# Altium schematic sheet CCM4201S_MAIN_Board_V1-PIJIAKUN_20260819_SCH.SchDoc
size D; SheetNumber: 1; SheetTotal: 1
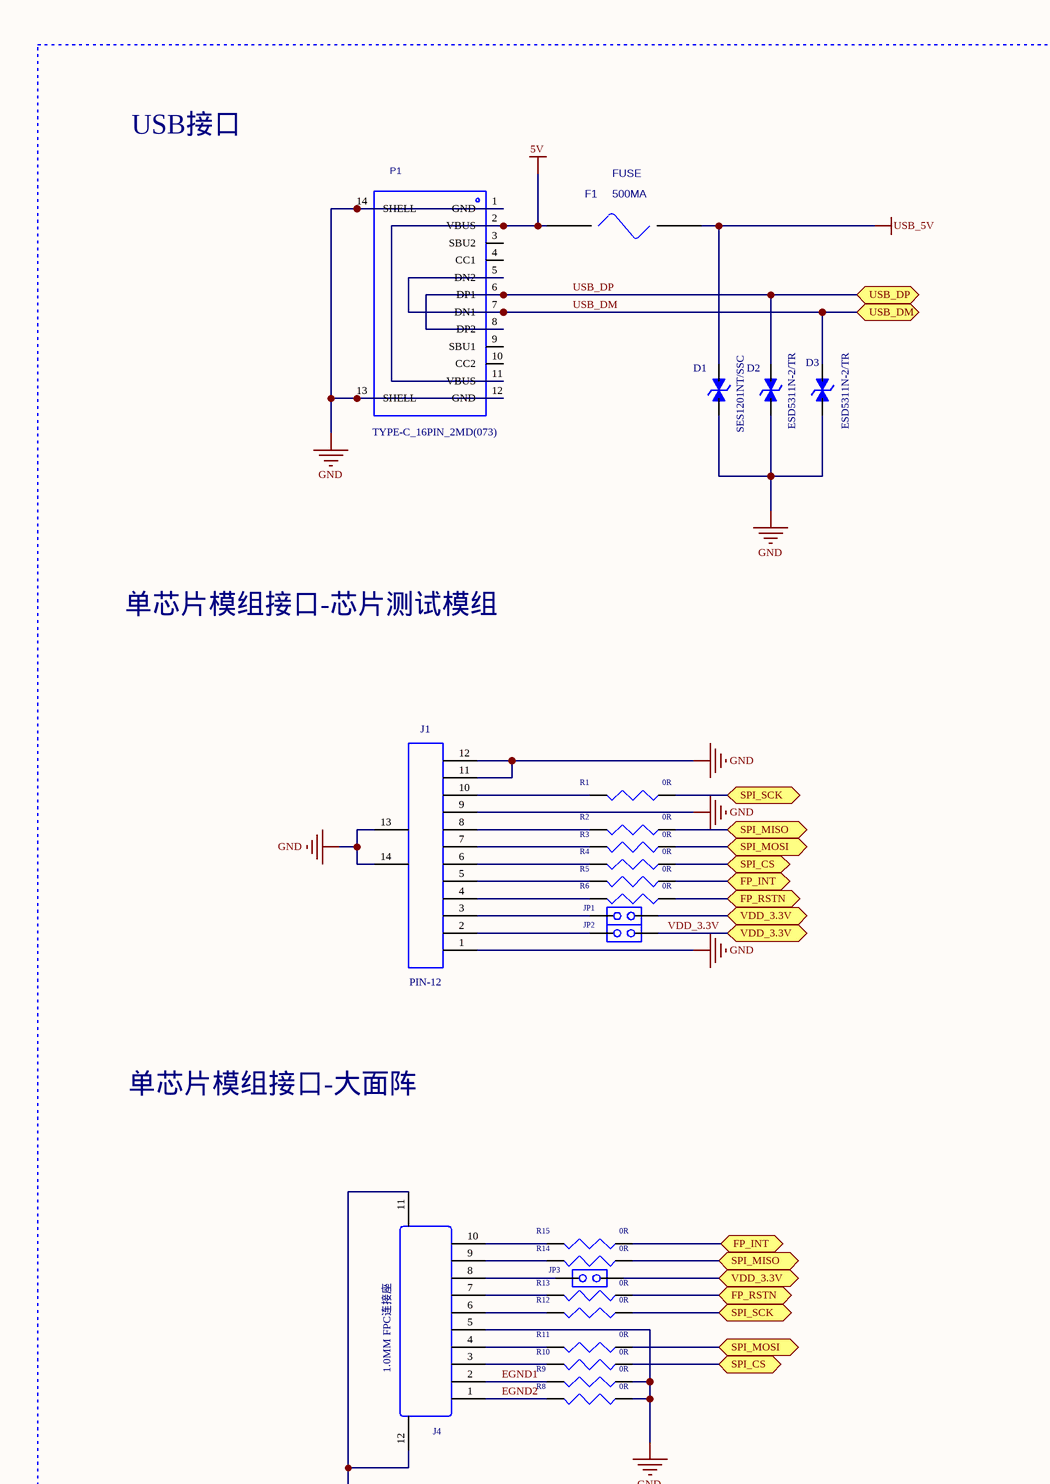
[diagram p0: CCM4201S_MAIN_Board_V1-PIJIAKUN_20260819_SCH.SchDoc, top left]
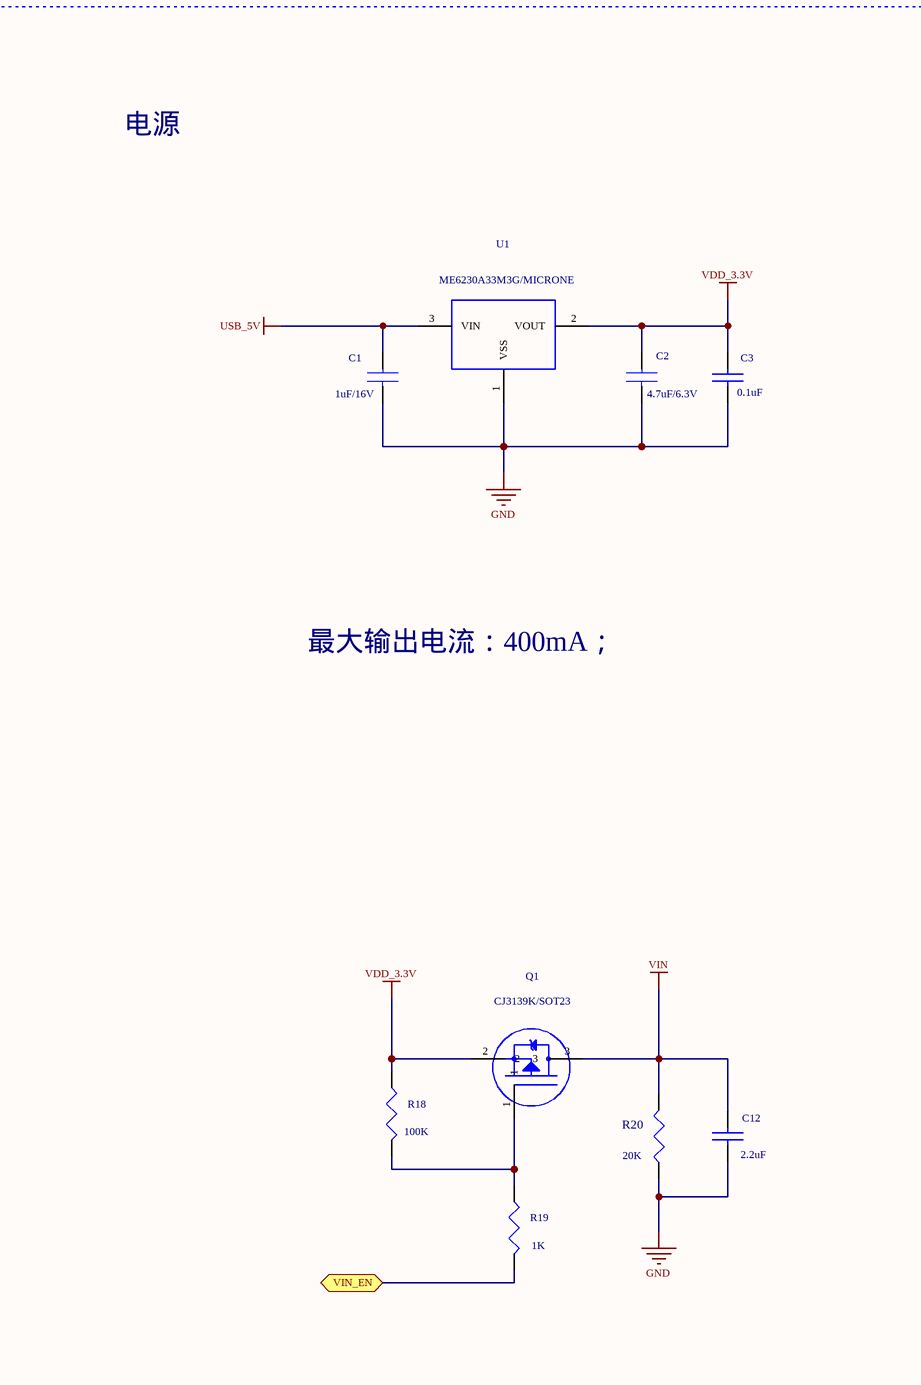
[diagram p1: CCM4201S_MAIN_Board_V1-PIJIAKUN_20260819_SCH.SchDoc, top middle]
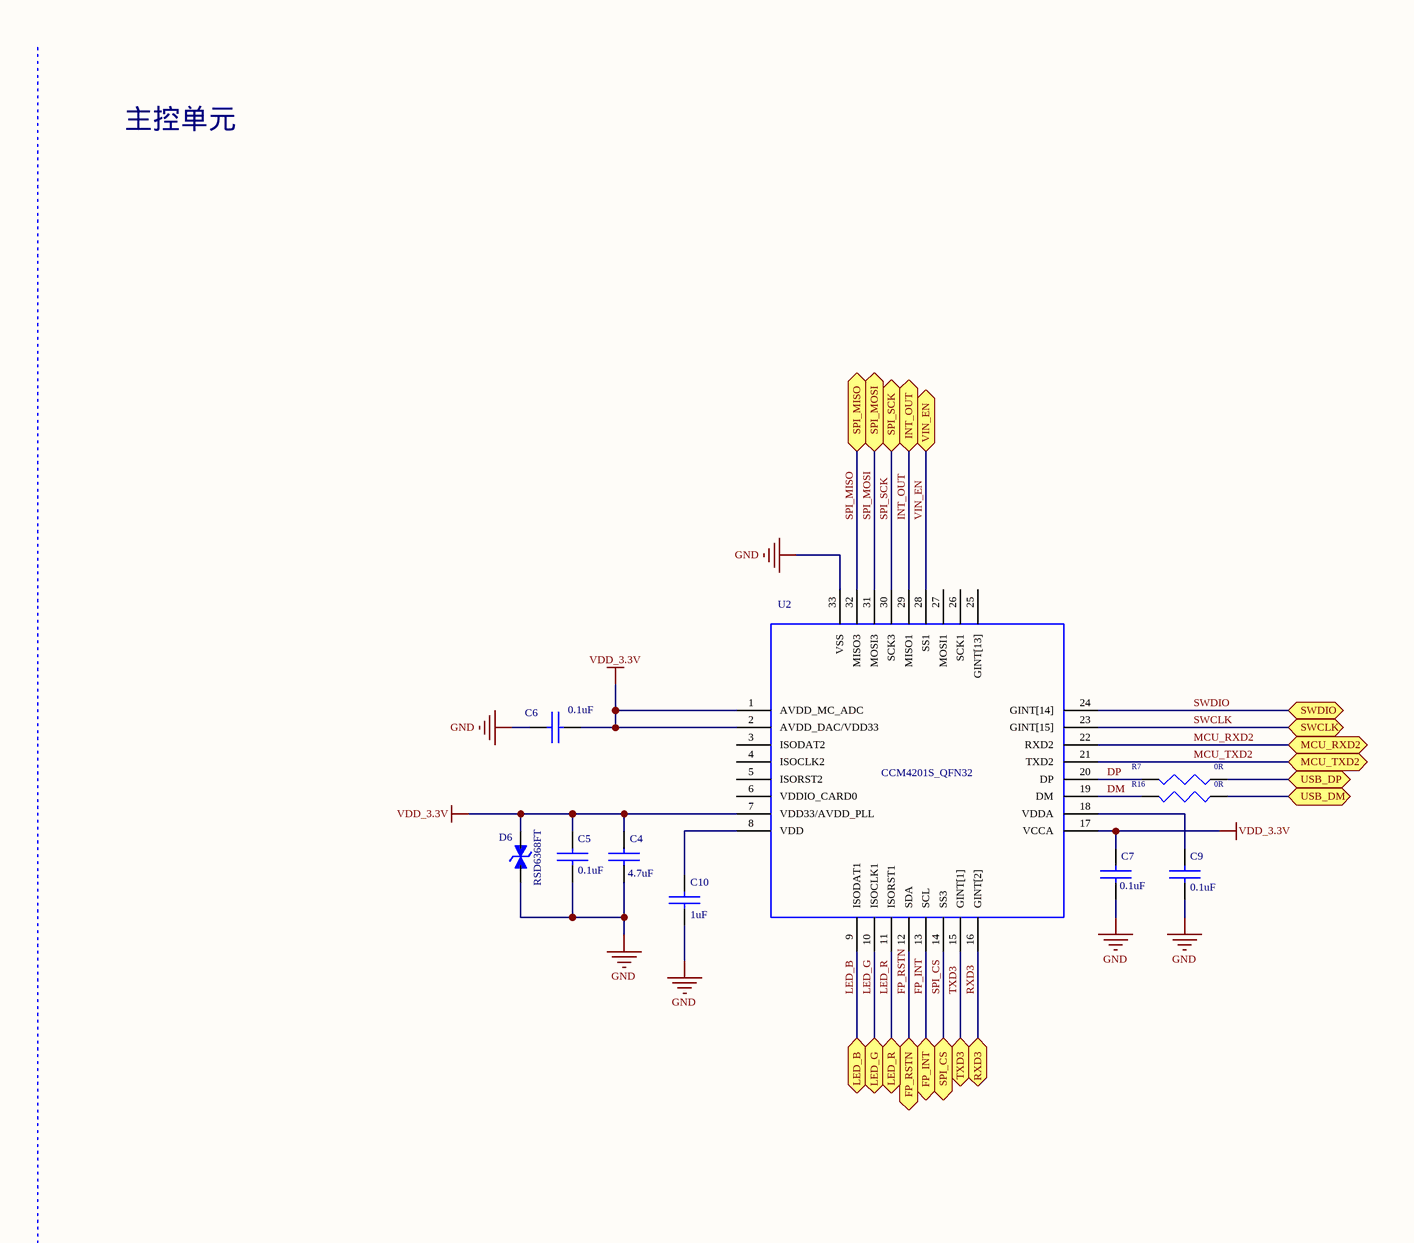
[diagram p2: CCM4201S_MAIN_Board_V1-PIJIAKUN_20260819_SCH.SchDoc, top right]
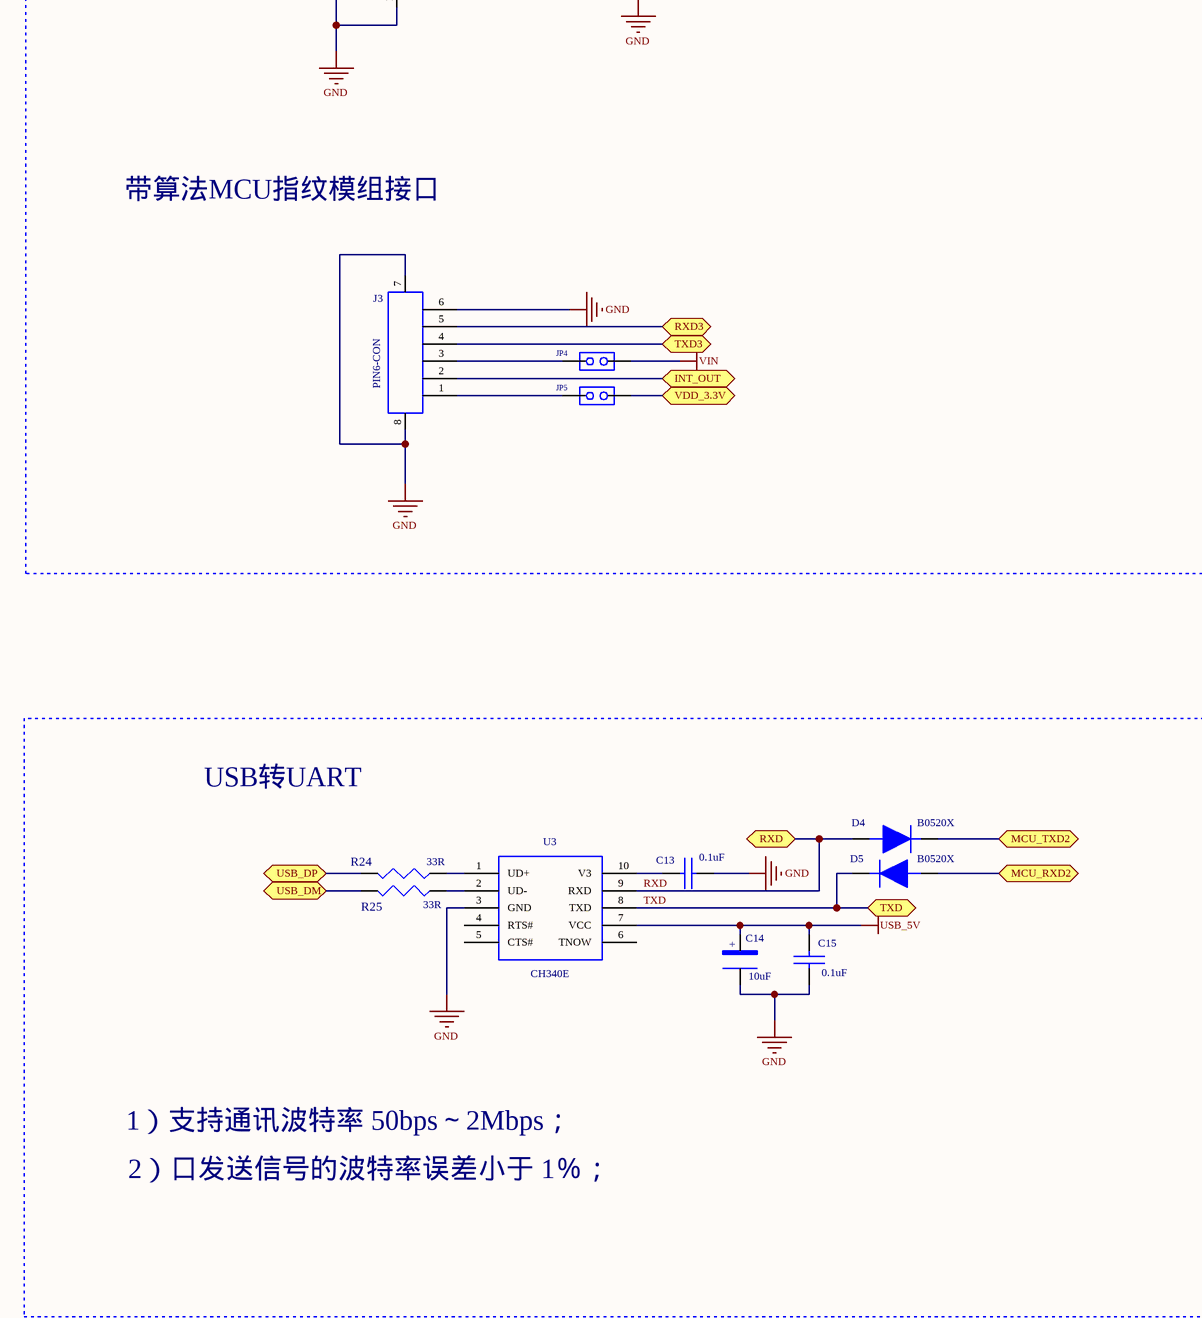
[diagram p3: CCM4201S_MAIN_Board_V1-PIJIAKUN_20260819_SCH.SchDoc, bottom left]
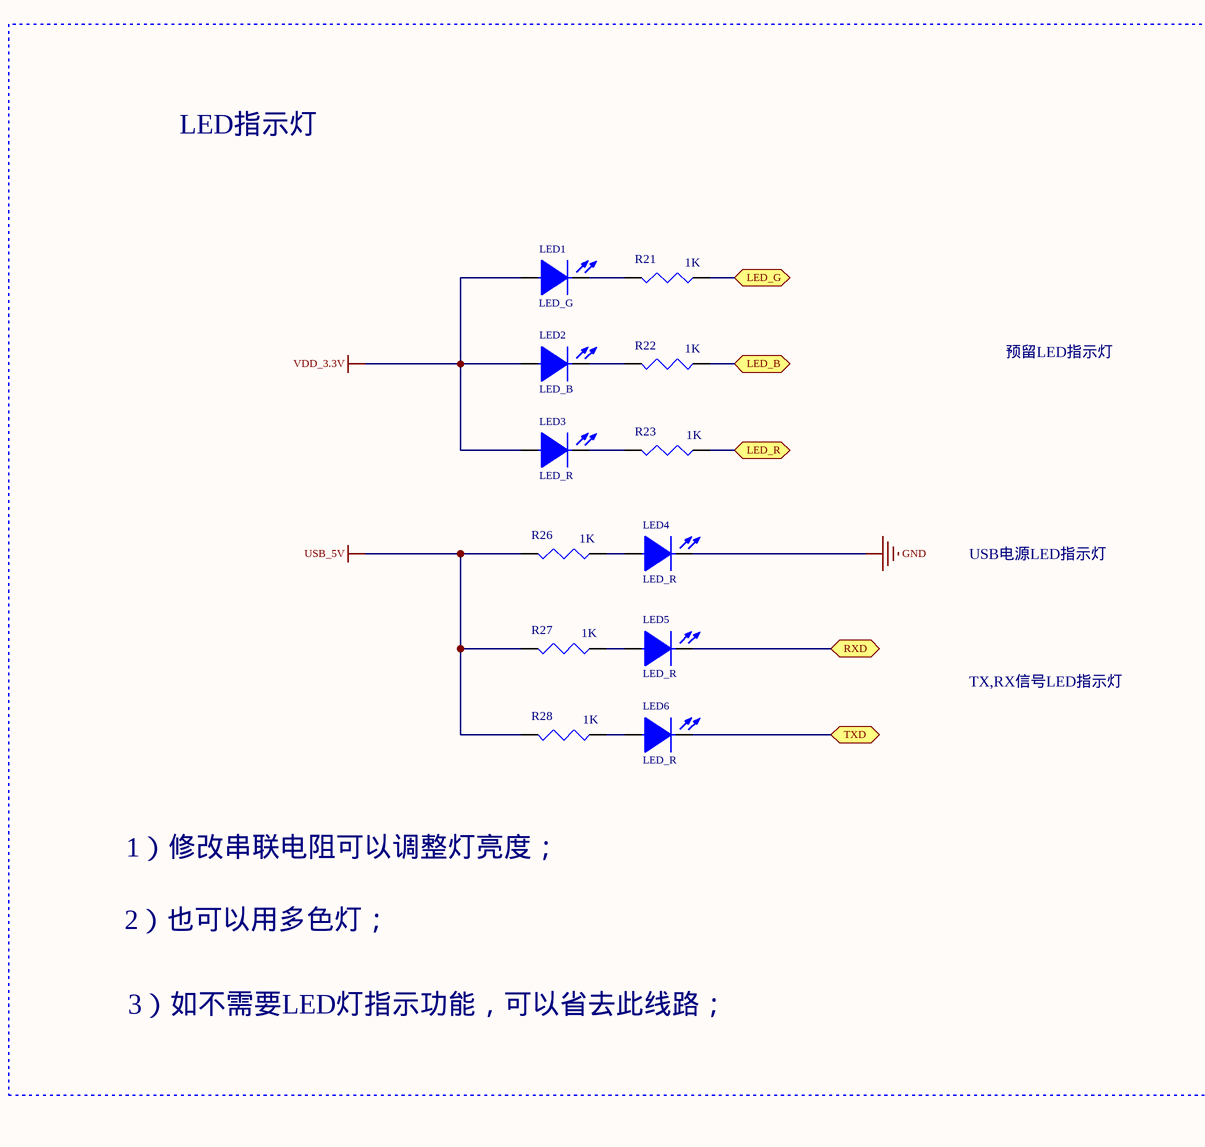
[diagram p4: CCM4201S_MAIN_Board_V1-PIJIAKUN_20260819_SCH.SchDoc, bottom middle]
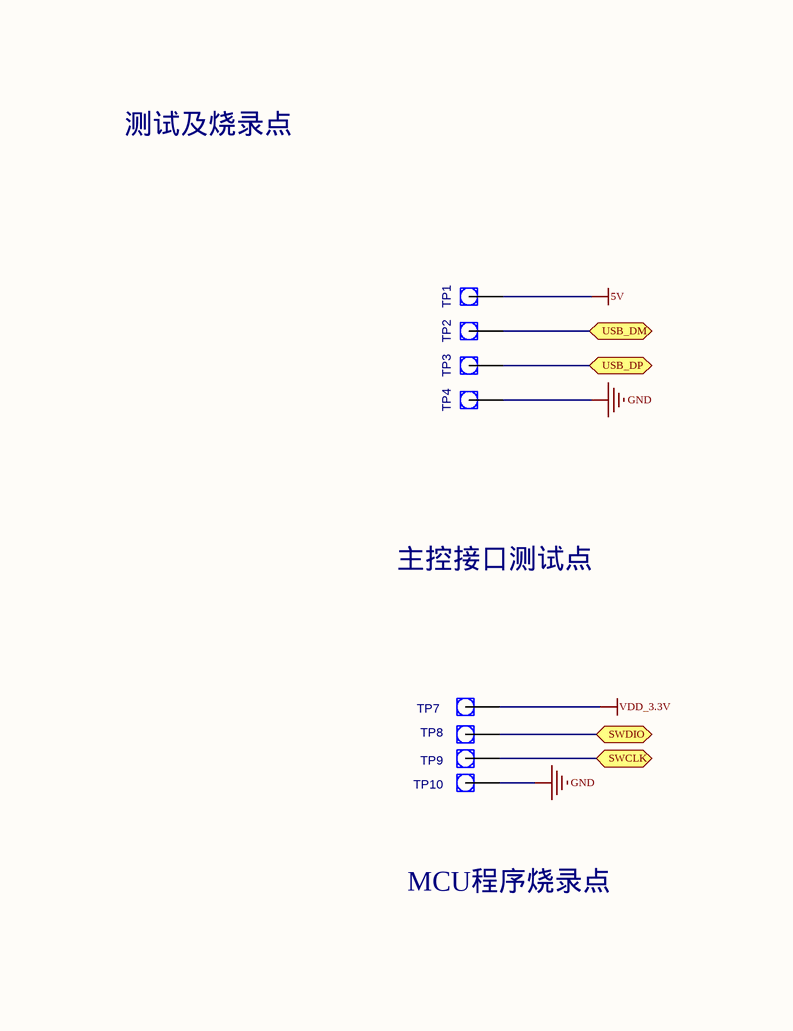
[diagram p5: CCM4201S_MAIN_Board_V1-PIJIAKUN_20260819_SCH.SchDoc, bottom right]

## Parts
C1  1uF/16V  [0402C]
C2  4.7uF/6.3V  [0402C]
C3  0.1uF  [0402C]
C4  4.7uF  [0402C]
C5  0.1uF  [0402C]
C6  0.1uF  [0402C]
C7  0.1uF  [0402C]
C9  0.1uF  [0402C]
C10  1uF  [0402C]
C12  2.2uF  [0402C]
C13  0.1uF  [0402C]
C14  10uF  [L0805]
C15  0.1uF  [0402C]
D1  SES1201NT/SSC  [TVS0402(M)]
D2  ESD5311N-2/TR  [TVS0402(M)]
D3  ESD5311N-2/TR  [TVS0402(M)]
D4  B0520X  [SOD523]
D5  B0520X  [SOD523]
D6  RSD6368FT  [TVS0402(M)]
F1  FUSE  value 500MA  [0603-PUSE]
J1  PIN-12  [PIN-12]
J3  PIN6-CON  [XH6PIN_1.0MM]
J4  Contributor: 1.0MM FPC连接座  [FPC-SMD_10P-P1.0_FGS-XJ-H2.0]  (hidden comment: AFA01-S10FCA-00)
JP1  CONDIP2_A  [PAIZHEN-1.27-2P]  (value not drawn)
JP2  CONDIP2_A  [PAIZHEN-1.27-2P]  (value not drawn)
JP3  CONDIP2_A  [PAIZHEN-1.27-2P]  (value not drawn)
JP4  CONDIP2_A  [PAIZHEN-1.27-2P]  (value not drawn)
JP5  CONDIP2_A  [PAIZHEN-1.27-2P]  (value not drawn)
LED1  LED_G  [LED_G]
LED2  LED_B  [LED_G]
LED3  LED_R  [LED_G]
LED4  LED_R  [LED_G]
LED5  LED_R  [LED_G]
LED6  LED_R  [LED_G]
P1  TYPE-C_16PIN_2MD(073)  [USB-C-SMD_TYPE-C-6PIN-2MD-073]
Q1  CJ3139K/SOT23  [SOT23]
R1  value 0R  [0402R]  (hidden comment: R0402)
R2  value 0R  [0402R]  (hidden comment: R0402)
R3  value 0R  [0402R]  (hidden comment: R0402)
R4  value 0R  [0402R]  (hidden comment: R0402)
R5  value 0R  [0402R]  (hidden comment: R0402)
R6  value 0R  [0402R]  (hidden comment: R0402)
R7  value 0R  [0402R]  (hidden comment: R0402)
R8  value 0R  [0402R]  (hidden comment: R0402)
R9  value 0R  [0402R]  (hidden comment: R0402)
R10  value 0R  [0402R]  (hidden comment: R0402)
R11  value 0R  [0402R]  (hidden comment: R0402)
R12  value 0R  [0402R]  (hidden comment: R0402)
R13  value 0R  [0402R]  (hidden comment: R0402)
R14  value 0R  [0402R]  (hidden comment: R0402)
R15  value 0R  [0402R]  (hidden comment: R0402)
R16  value 0R  [0402R]  (hidden comment: R0402)
R18  100K  [0402R]
R19  1K  [0402R]
R20  20K  [0402R]
R21  1K  [0402R]
R22  1K  [0402R]
R23  1K  [0402R]
R24  33R  [0402R]
R25  33R  [0402R]
R26  1K  [0402R]
R27  1K  [0402R]
R28  1K  [0402R]
TP1  TP12  [TPAA]  (value not drawn)
TP2  TP12  [TPAA]  (value not drawn)
TP3  TP12  [TPAA]  (value not drawn)
TP4  TP12  [TPAA]  (value not drawn)
TP7  TP12  [TPAA]  (value not drawn)
TP8  TP12  [TPAA]  (value not drawn)
TP9  TP12  [TPAA]  (value not drawn)
TP10  TP12  [TPAA]  (value not drawn)
U1  ME6230A33M3G/MICRONE  [SOT23-3]
U2  CCM4201S_QFN32  [QFN32_4X4_0.4]
U3  CH340E  [MSOP-10]

## Ports
FP_INT (bidir, see CCM4201S_MAIN_Board_V1-PIJIAKUN_20260819_SCH[2B]), FP_INT (bidir, see CCM4201S_MAIN_Board_V1-PIJIAKUN_20260819_SCH[2B], CCM4201S_MAIN_Board_V1-PIJIAKUN_20260819_SCH[7B]), FP_RSTN (bidir, see CCM4201S_MAIN_Board_V1-PIJIAKUN_20260819_SCH[2B]), FP_RSTN (bidir, see CCM4201S_MAIN_Board_V1-PIJIAKUN_20260819_SCH[2B], CCM4201S_MAIN_Board_V1-PIJIAKUN_20260819_SCH[7B]), INT_OUT (bidir, see CCM4201S_MAIN_Board_V1-PIJIAKUN_20260819_SCH[2C]), INT_OUT (bidir, see CCM4201S_MAIN_Board_V1-PIJIAKUN_20260819_SCH[7A]), LED_B (bidir, see CCM4201S_MAIN_Board_V1-PIJIAKUN_20260819_SCH[4C]), LED_B (bidir, see CCM4201S_MAIN_Board_V1-PIJIAKUN_20260819_SCH[7B]), LED_G (bidir, see CCM4201S_MAIN_Board_V1-PIJIAKUN_20260819_SCH[4C]), LED_G (bidir, see CCM4201S_MAIN_Board_V1-PIJIAKUN_20260819_SCH[7B]), LED_R (bidir, see CCM4201S_MAIN_Board_V1-PIJIAKUN_20260819_SCH[4C]), LED_R (bidir, see CCM4201S_MAIN_Board_V1-PIJIAKUN_20260819_SCH[7B]), MCU_RXD2 (bidir, see CCM4201S_MAIN_Board_V1-PIJIAKUN_20260819_SCH[3C]), MCU_RXD2 (bidir, see CCM4201S_MAIN_Board_V1-PIJIAKUN_20260819_SCH[7B]), MCU_TXD2 (bidir, see CCM4201S_MAIN_Board_V1-PIJIAKUN_20260819_SCH[3C]), MCU_TXD2 (bidir, see CCM4201S_MAIN_Board_V1-PIJIAKUN_20260819_SCH[7B]), RXD3 (bidir, see CCM4201S_MAIN_Board_V1-PIJIAKUN_20260819_SCH[2C]), RXD3 (bidir, see CCM4201S_MAIN_Board_V1-PIJIAKUN_20260819_SCH[7B]), RXD (bidir, see CCM4201S_MAIN_Board_V1-PIJIAKUN_20260819_SCH[2C]), RXD (bidir, see CCM4201S_MAIN_Board_V1-PIJIAKUN_20260819_SCH[5C]), SPI_CS (bidir, see CCM4201S_MAIN_Board_V1-PIJIAKUN_20260819_SCH[2B]), SPI_CS (bidir, see CCM4201S_MAIN_Board_V1-PIJIAKUN_20260819_SCH[2B], CCM4201S_MAIN_Board_V1-PIJIAKUN_20260819_SCH[7B]), SPI_MISO (bidir, see CCM4201S_MAIN_Board_V1-PIJIAKUN_20260819_SCH[2B]), SPI_MISO (bidir, see CCM4201S_MAIN_Board_V1-PIJIAKUN_20260819_SCH[2B], CCM4201S_MAIN_Board_V1-PIJIAKUN_20260819_SCH[7A]), SPI_MOSI (bidir, see CCM4201S_MAIN_Board_V1-PIJIAKUN_20260819_SCH[2B]), SPI_MOSI (bidir, see CCM4201S_MAIN_Board_V1-PIJIAKUN_20260819_SCH[2B], CCM4201S_MAIN_Board_V1-PIJIAKUN_20260819_SCH[7A]), SPI_SCK (bidir, see CCM4201S_MAIN_Board_V1-PIJIAKUN_20260819_SCH[2B]), SPI_SCK (bidir, see CCM4201S_MAIN_Board_V1-PIJIAKUN_20260819_SCH[2B], CCM4201S_MAIN_Board_V1-PIJIAKUN_20260819_SCH[7A]), SWCLK (bidir, see CCM4201S_MAIN_Board_V1-PIJIAKUN_20260819_SCH[6D]), SWCLK (bidir, see CCM4201S_MAIN_Board_V1-PIJIAKUN_20260819_SCH[7B]), SWDIO (bidir, see CCM4201S_MAIN_Board_V1-PIJIAKUN_20260819_SCH[6D]), SWDIO (bidir, see CCM4201S_MAIN_Board_V1-PIJIAKUN_20260819_SCH[7B]), TXD3 (bidir, see CCM4201S_MAIN_Board_V1-PIJIAKUN_20260819_SCH[2C]), TXD3 (bidir, see CCM4201S_MAIN_Board_V1-PIJIAKUN_20260819_SCH[7B]), TXD (bidir, see CCM4201S_MAIN_Board_V1-PIJIAKUN_20260819_SCH[3D]), TXD (bidir, see CCM4201S_MAIN_Board_V1-PIJIAKUN_20260819_SCH[5D]), USB_DM (bidir, see CCM4201S_MAIN_Board_V1-PIJIAKUN_20260819_SCH[2D], CCM4201S_MAIN_Board_V1-PIJIAKUN_20260819_SCH[3A], CCM4201S_MAIN_Board_V1-PIJIAKUN_20260819_SCH[6C]), USB_DM (bidir, see CCM4201S_MAIN_Board_V1-PIJIAKUN_20260819_SCH[2D], CCM4201S_MAIN_Board_V1-PIJIAKUN_20260819_SCH[3A], CCM4201S_MAIN_Board_V1-PIJIAKUN_20260819_SCH[7B]), USB_DM (bidir, see CCM4201S_MAIN_Board_V1-PIJIAKUN_20260819_SCH[2D], CCM4201S_MAIN_Board_V1-PIJIAKUN_20260819_SCH[6C], CCM4201S_MAIN_Board_V1-PIJIAKUN_20260819_SCH[7B]), USB_DM (bidir, see CCM4201S_MAIN_Board_V1-PIJIAKUN_20260819_SCH[3A], CCM4201S_MAIN_Board_V1-PIJIAKUN_20260819_SCH[6C], CCM4201S_MAIN_Board_V1-PIJIAKUN_20260819_SCH[7B]), USB_DP (bidir, see CCM4201S_MAIN_Board_V1-PIJIAKUN_20260819_SCH[2C], CCM4201S_MAIN_Board_V1-PIJIAKUN_20260819_SCH[3A], CCM4201S_MAIN_Board_V1-PIJIAKUN_20260819_SCH[6C]), USB_DP (bidir, see CCM4201S_MAIN_Board_V1-PIJIAKUN_20260819_SCH[2C], CCM4201S_MAIN_Board_V1-PIJIAKUN_20260819_SCH[3A], CCM4201S_MAIN_Board_V1-PIJIAKUN_20260819_SCH[7B]), USB_DP (bidir, see CCM4201S_MAIN_Board_V1-PIJIAKUN_20260819_SCH[2C], CCM4201S_MAIN_Board_V1-PIJIAKUN_20260819_SCH[6C], CCM4201S_MAIN_Board_V1-PIJIAKUN_20260819_SCH[7B]), USB_DP (bidir, see CCM4201S_MAIN_Board_V1-PIJIAKUN_20260819_SCH[3A], CCM4201S_MAIN_Board_V1-PIJIAKUN_20260819_SCH[6C], CCM4201S_MAIN_Board_V1-PIJIAKUN_20260819_SCH[7B]), VDD_3.3V (bidir, see CCM4201S_MAIN_Board_V1-PIJIAKUN_20260819_SCH[2B]), VDD_3.3V (bidir, see CCM4201S_MAIN_Board_V1-PIJIAKUN_20260819_SCH[2B], CCM4201S_MAIN_Board_V1-PIJIAKUN_20260819_SCH[2C]), VIN_EN (bidir, see CCM4201S_MAIN_Board_V1-PIJIAKUN_20260819_SCH[4B]), VIN_EN (bidir, see CCM4201S_MAIN_Board_V1-PIJIAKUN_20260819_SCH[7A])

## Nets
5V: F1.1 P1.2(VBUS) P1.11(VBUS) TP1.1
GND: C1.2 C2.2 C3.2 C4.2 C5.2 C6.1 C7.2 C9.2 C10.2 C12.2 C13.2 C14.2 C15.2 D1.1 D2.1 D3.1 D6.2 J1.1 J1.9 J1.11 J1.12 J1.13 J1.14 J3.6 J3.7 J3.8 J4.5 J4.11 J4.12 LED4.2 P1.1(GND) P1.12(GND) P1.13(SHELL) P1.14(SHELL) R8.1 R9.1 R20.1 TP4.1 TP10.1 U1.1(VSS) U2.33(VSS) U3.3(GND)
USB_5V: C1.1 C14.1 C15.1 D1.2 F1.2 R26.2 R27.2 R28.2 U1.3(VIN) U3.7(VCC)
VDD_3.3V: C2.1 C3.1 C4.1 C5.1 C6.2 C7.1 D6.1 JP1.1 JP2.1 JP3.1 JP5.1 LED1.1 LED2.1 LED3.1 Q1.2 R18.2 TP7.1 U1.2(VOUT) U2.1(AVDD_MC_ADC) U2.2(AVDD_DAC/VDD33) U2.7(VDD33/AVDD_PLL) U2.17(VCCA) ; port VDD_3.3V
VIN: C12.1 JP4.1 Q1.3 R20.2
DM: R16.2 U2.19(DM)
DP: R7.2 U2.20(DP)
EGND1: J4.2 R9.2
EGND2: J4.1 R8.2
FP_INT: R5.1 R15.1 U2.13(SCL) ; port FP_INT
FP_RSTN: R6.1 R13.1 U2.12(SDA) ; port FP_RSTN
INT_OUT: J3.2 U2.29(MISO1) ; port INT_OUT
LED_B: R22.1 U2.9(ISODAT1) ; port LED_B
LED_G: R21.1 U2.10(ISOCLK1) ; port LED_G
LED_R: R23.1 U2.11(ISORST1) ; port LED_R
MCU_RXD2: D5.A U2.22(RXD2) ; port MCU_RXD2
MCU_TXD2: D4.K U2.21(TXD2) ; port MCU_TXD2
RXD: D4.A LED5.2 U3.9(RXD) ; port RXD
RXD3: J3.5 U2.16(GINT[2]) ; port RXD3
SPI_CS: R4.1 R10.1 U2.14(SS3) ; port SPI_CS
SPI_MISO: R2.1 R14.1 U2.32(MISO3) ; port SPI_MISO
SPI_MOSI: R3.1 R11.1 U2.31(MOSI3) ; port SPI_MOSI
SPI_SCK: R1.1 R12.1 U2.30(SCK3) ; port SPI_SCK
SWCLK: TP9.1 U2.23(GINT[15]) ; port SWCLK
SWDIO: TP8.1 U2.24(GINT[14]) ; port SWDIO
TXD: D5.K LED6.2 U3.8(TXD) ; port TXD
TXD3: J3.4 U2.15(GINT[1]) ; port TXD3
USB_DM: D3.2 P1.5(DN2) P1.7(DN1) R16.1 R25.2 TP2.1 ; port USB_DM
USB_DP: D2.2 P1.6(DP1) P1.8(DP2) R7.1 R24.2 TP3.1 ; port USB_DP
VIN_EN: R19.1 U2.28(SS1) ; port VIN_EN
NetC9_1: C9.1 U2.18(VDDA)
NetC10_1: C10.1 U2.8(VDD)
NetC13_1: C13.1 U3.10(V3)
NetJ1_2: J1.2 JP2.2
NetJ1_3: J1.3 JP1.2
NetJ1_4: J1.4 R6.2
NetJ1_5: J1.5 R5.2
NetJ1_6: J1.6 R4.2
NetJ1_7: J1.7 R3.2
NetJ1_8: J1.8 R2.2
NetJ1_10: J1.10 R1.2
NetJ3_1: J3.1 JP5.2
NetJ3_3: J3.3 JP4.2
NetJ4_3: J4.3 R10.2
NetJ4_4: J4.4 R11.2
NetJ4_6: J4.6 R12.2
NetJ4_7: J4.7 R13.2
NetJ4_8: J4.8 JP3.2
NetJ4_9: J4.9 R14.2
NetJ4_10: J4.10 R15.2
NetLED1_2: LED1.2 R21.2
NetLED2_2: LED2.2 R22.2
NetLED3_2: LED3.2 R23.2
NetLED4_1: LED4.1 R26.1
NetLED5_1: LED5.1 R27.1
NetLED6_1: LED6.1 R28.1
NetQ1_1: Q1.1 R18.1 R19.2
NetR24_1: R24.1 U3.1(UD+)
NetR25_1: R25.1 U3.2(UD-)

Not connected (* = marked no-connect by the designer): P1 3(SBU2) 4(CC1) 9(SBU1) 10(CC2); U2 3(ISODAT2) 4(ISOCLK2) 5(ISORST2) 6(VDDIO_CARD0) 25(GINT[13]) 26(SCK1) 27(MOSI1); U3 4(RTS#) 5(CTS#) 6(TNOW)

## Notes on the sheet
- USB接口
- 电源
- 主控单元
- 单芯片模组接口-芯片测试模组
- 最大输出电流：400mA；
- 单芯片模组接口-大面阵
- 带算法MCU指纹模组接口
- LED指示灯
- 测试及烧录点
- 预留LED指示灯
- USB转UART
- USB电源LED指示灯
- 主控接口测试点
- TX,RX信号LED指示灯
- 1）修改串联电阻可以调整灯亮度；
- 1）支持通讯波特率 50bps～2Mbps；
- 2）也可以用多色灯；
- MCU程序烧录点
- 2）口发送信号的波特率误差小于 1％；
- 3）如不需要LED灯指示功能，可以省去此线路；
- THIS DOCUMENT AND THE DATA DISCLOSED HEREIN OR
- HEREWITH IS THE PROPERTY OF ALTIUM LIMITED AND MAY
- DWG NO:
- REVISION
- REV:
- DESCRIPTION
- DATE
- APPROVED
- BE FREELY DISTRIBUTED IN WHOLE. NO RIGHTS ARE
- RESERVED OR EXPRESS OR IMPLIED WARANTEE GIVEN.
- ENG:
- APPROVALS
- PROJECT
- DSN:
- CHK:
- REFERENCE DOCUMENTS
- PROJECT REVISION:
- TITLE
- DOCUMENT REVISION:
- DESIGN ITEM:
- BOM:
- FAB DWG:
- PCB DWG:
- ASSY DWG:
- SCALE:
- A3
- SIZE
- CAGE CODE
- FILE NAME
- DWG NO.
- SHEET
- OF
- REV
- (in symbol CAP+) +

## Library data of the parts
C1 C2 = C0603X: CAP, 10UF, 20%, 10V, X5R, 0603; Manufacturer #1: 村田 muRata; Manufacturer: muRata (村田); PCB_DECAL: C0805; Process: SMT; Geometry.Height: 1.45000mm; PCB DECAL: 0402C
C3 C5-C7 C9 = C0402: CAP, 0.1uF, 10%, 10V, X5R, 0402; Manufacturer #1: 村田 muRata; PCB DECAL: 0402C
C4 C10 = C0402: CAP, 1UF, 10%, 10V, X5R, 0402; Manufacturer #1: 村田 muRata; PCB DECAL: 0402C
C12 = C0201: CAP, 2.2uF, 10%, 10V, X5R, 0201; Manufacturer #1: 村田 muRata; PCB DECAL: 0402C
C13 C15 = C0201: CAP, 0.1uF, 10%, 10V, X5R, 0201; Manufacturer #1: 村田 muRata; Source_Path: D:\王君资料\客户资料\奥美佳\TDC5502\SCHEMATIC\改过原理图\TDC5502 1210B56101MN32SSD32FTD020EARIGBT.DSN; PCB DECAL: 0402C
C14 = CAP+: CAP, 10uF, 10%, 16V  6.3*5.3mm SMD; Geometry.Height: 1.19990mm; PCB DECAL: L0805
D1 = TVS0402(M): TVS/12V; Part Number: 1.5KE220; Manufacturer #1: MOTOROLA; Source_Path: D:\工作资料\指纹锁\电子烟\TF30X原理图\TF30X-GSL6165S-V00.DSN; PCB DECAL: TVS0402(M)
D2 D3 = TVS0402(M): TVS/5V; Part Number: 1.5KE220; Manufacturer #1: MOTOROLA; Source_Path: D:\工作资料\指纹锁\电子烟\TF30X原理图\TF30X-GSL6165S-V00.DSN; PCB DECAL: TVS0402(M)
D4 D5 = DIODE: Value: B0520; PCB DECAL: SOD523
D6 = TVS0402(M): TRANSIENT VOLTAGE SUPPRESSOR, VBR=220V; Part Number: 1.5KE220; Manufacturer #1: MOTOROLA; Source_Path: D:\工作资料\指纹锁\电子烟\TF30X原理图\TF30X-GSL6165S-V00.DSN; Value: RSFK9D3NT; Geometry.Height: 1.10007mm; PCB DECAL: TVS0402(M)
F1 = FUSE: Source_Path: C:\PROGRAM FILES\CADENCE\SPB_15.7\TOOLS\CAPTURE\LIBRARY\OLDLIBS\DEVICE.OLB; PCB DECAL: 0603-PUSE
J4 = AFA01-S10FCA-00: BOM_Manufacturer: JUSHUO; BOM_Supplier: LCSC; BOM_Supplier_Part: C262756; BOM_Manufacturer_Part: AFA01-S10FCA-00; BOM_JLCPCB_Part_Class: Extended Part; spicePre: F; spiceSymbolName: AFA01-S10FCA-00; PCB DECAL: FPC-SMD_10P-P1.0_FGS-XJ-H2.0
JP1-JP5 = CONDIP2_A: Rechargeable Battery; Value: 4.2V/0.5A; PCB DECAL: PAIZHEN-1.27-2P
LED1-LED6 = OLED: Geometry.Height: 1.100mm; PCB DECAL: LED_G
P1 = TYPE-C_16PIN_2MD(073): Symbol: TYPE-C 16PIN 2MD(073); Add_into_BOM: yes; Connector_Type: Type-C; Number_of_Contacts: 16; Number_of_Ports: 1; Current_Rating___Power_(Max): 5A; Name: =Manufacturer Part; Device: TYPE-C 16PIN 2MD(073); Supplier_Part: C2765186; Manufacturer_Part: TYPE-C 16PIN 2MD(073); Supplier_Footprint: SMD; JLCPCB_Part_Class: Extended Part; Datasheet: https://atta.szlcsc.com/upload/public/pdf/source/20211123/39B17C16241EAC15C5E277BDA434118E.pdf; Supplier: LCSC; Convert_to_PCB: yes; Standard: -; PCB DECAL: USB-C-SMD_TYPE-C-6PIN-2MD-073
Q1 = PMOS: SOT23; Manufacturer #1: 长电科技; PCB DECAL: SOT23
R1-R16 = R0402: RES,330R, 5%, 1/10W, 0201, SMD; Manufacturer #1: Yageo; Part_Name: RES 0201; PCB DECAL: 0402R
R18 R19 = R0402H: RES 0603  4.7KΩ±1%  1/8W; PCB_DECAL: R0603; Specification: spec; Process: SMT; PCB DECAL: 0402R
R20-R23 R26-R28 = R0402: RES,20K, 5%, 1/10W, 0201, SMD; Manufacturer #1: Yageo; Part_Name: RES 0201; PCB DECAL: 0402R
R24 R25 = R0201: Source_Path: C:\PROGRAM FILES\ORCAD\CAPTURE\LIBRARY\DISCRETE.OLB; PCB DECAL: 0402R
TP1-TP4 TP7-TP10 = TP12: 测试点，不需要贴片; PCB DECAL: TPAA
U1 = TCS2115_C33: 3.3V  SOT23-3; Manufacturer #1: Torch_chip; PCB DECAL: SOT23-3
U3 = CH340E: Geometry.Height: 1.09mm; PCB DECAL: MSOP-10
J1 = PIN-12: PCB DECAL: PIN-12
J3 = PIN6-CON: PCB DECAL: XH6PIN_1.0MM
U2 = CCM4201S_QFN32: PCB DECAL: QFN32_4X4_0.4